# EAGLE design untitled 5 (EAGLE 7.5.0)
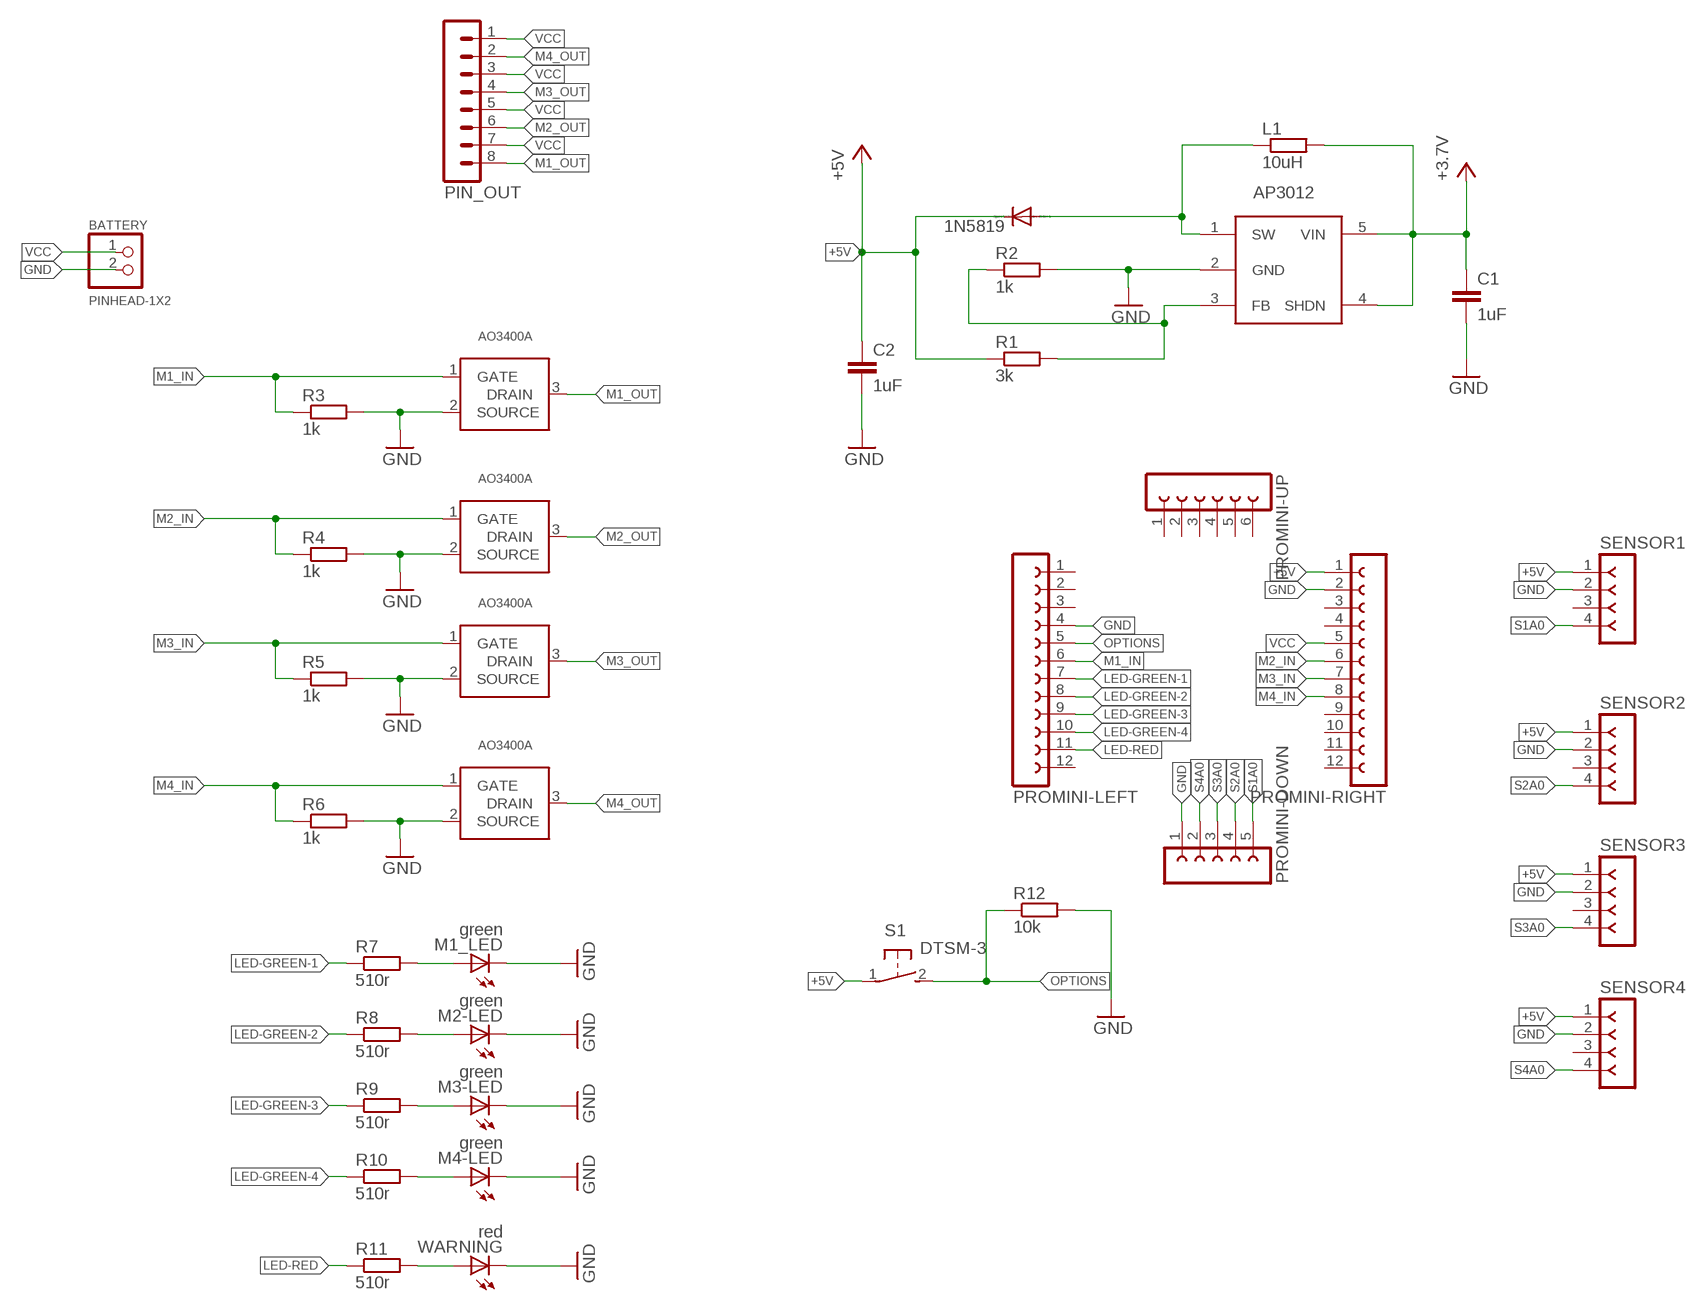
[diagram p0: schematic, sheet 1]

## Parts
1N5819  DIODE-DO214AC  [DO214AC]
BATTERY  PINHEAD-1X2  [PIHEAD-1X2]
C1  1uF  C-EUC1206  [C1206]
C2  1uF  C-EUC1206  [C1206]
L1  10uH  R-EU_R0805  [R0805]
M1_LED  green  LEDCHIP-LED0805  [CHIP-LED0805]
M2-LED  green  LEDCHIP-LED0805  [CHIP-LED0805]
M3-LED  green  LEDCHIP-LED0805  [CHIP-LED0805]
M4-LED  green  LEDCHIP-LED0805  [CHIP-LED0805]
MOSFET1  AO3400A  [SOT-23]
MOSFET2  AO3400A  [SOT-23]
MOSFET3  AO3400A  [SOT-23]
MOSFET4  AO3400A  [SOT-23]
PIN_OUT  MA08-1  [MA08-1]
PROMINI-DOWN  FE05-1  [FE05-1]
PROMINI-LEFT  FE12-1  [FE12]
PROMINI-RIGHT  FE12-1  [FE12]
PROMINI-UP  FE06-1  [FE06]
R1  3k  R-EU_R1206  [R1206]
R2  1k  R-EU_R1206  [R1206]
R3  1k  R-EU_R1206  [R1206]
R4  1k  R-EU_R1206  [R1206]
R5  1k  R-EU_R1206  [R1206]
R6  1k  R-EU_R1206  [R1206]
R7  510r  R-EU_M0805  [M0805]
R8  510r  R-EU_M0805  [M0805]
R9  510r  R-EU_M0805  [M0805]
R10  510r  R-EU_M0805  [M0805]
R11  510r  R-EU_M0805  [M0805]
R12  10k  R-EU_R1206  [R1206]
S1  DTSM-3  [DTSM-3]
SENSOR1  F-1X04-SIP-100-32Y  [SIP-100-04-32Y]
SENSOR2  F-1X04-SIP-100-32Y  [SIP-100-04-32Y]
SENSOR3  F-1X04-SIP-100-32Y  [SIP-100-04-32Y]
SENSOR4  F-1X04-SIP-100-32Y  [SIP-100-04-32Y]
U$1  AP3012  [SOT-23-5]
WARNING  red  LEDCHIP-LED0805  [CHIP-LED0805]

## Nets
+5V: 1N5819.C C2.1 PROMINI-RIGHT.1 R1.1 S1.1 SENSOR1.1 SENSOR2.1 SENSOR3.1 SENSOR4.1
GND: BATTERY.2 C1.2 C2.2 M1_LED.C M2-LED.C M3-LED.C M4-LED.C MOSFET1.2(SOURCE) MOSFET2.2(SOURCE) MOSFET3.2(SOURCE) MOSFET4.2(SOURCE) PROMINI-DOWN.1 PROMINI-LEFT.4 PROMINI-RIGHT.2 R2.2 R3.2 R4.2 R5.2 R6.2 R12.2 SENSOR1.2 SENSOR2.2 SENSOR3.2 SENSOR4.2 U$1.2(GND) WARNING.C
LED-GREEN-1: PROMINI-LEFT.7 R7.1
LED-GREEN-2: PROMINI-LEFT.8 R8.1
LED-GREEN-3: PROMINI-LEFT.9 R9.1
LED-GREEN-4: PROMINI-LEFT.10 R10.1
LED-RED: PROMINI-LEFT.11 R11.1
M1_IN: MOSFET1.1(GATE) PROMINI-LEFT.6 R3.1
M1_OUT: MOSFET1.3(DRAIN) PIN_OUT.8
M2_IN: MOSFET2.1(GATE) PROMINI-RIGHT.6 R4.1
M2_OUT: MOSFET2.3(DRAIN) PIN_OUT.6
M3_IN: MOSFET3.1(GATE) PROMINI-RIGHT.7 R5.1
M3_OUT: MOSFET3.3(DRAIN) PIN_OUT.4
M4_IN: MOSFET4.1(GATE) PROMINI-RIGHT.8 R6.1
M4_OUT: MOSFET4.3(DRAIN) PIN_OUT.2
N$1: 1N5819.A L1.1 U$1.1(SW)
N$3: R1.2 R2.1 U$1.3(FB)
N$4: R11.2 WARNING.A
N$5: M4-LED.A R10.2
N$6: M3-LED.A R9.2
N$7: M2-LED.A R8.2
N$8: M1_LED.A R7.2
OPTIONS: PROMINI-LEFT.5 R12.1 S1.2
S1A0: PROMINI-DOWN.5 SENSOR1.4
S2A0: PROMINI-DOWN.4 SENSOR2.4
S3A0: PROMINI-DOWN.3 SENSOR3.4
S4A0: PROMINI-DOWN.2 SENSOR4.4
VCC: BATTERY.1 C1.1 L1.2 PIN_OUT.1 PIN_OUT.3 PIN_OUT.5 PIN_OUT.7 PROMINI-RIGHT.5 U$1.4(SHDN) U$1.5(VIN) ; supply symbol labelled +3.7V
Unconnected: PROMINI-LEFT.1 PROMINI-LEFT.2 PROMINI-LEFT.3 PROMINI-LEFT.12 PROMINI-RIGHT.3 PROMINI-RIGHT.4 PROMINI-RIGHT.9 PROMINI-RIGHT.10 PROMINI-RIGHT.11 PROMINI-RIGHT.12 PROMINI-UP.1 PROMINI-UP.2 PROMINI-UP.3 PROMINI-UP.4 PROMINI-UP.5 PROMINI-UP.6 SENSOR1.3 SENSOR2.3 SENSOR3.3 SENSOR4.3

## Library data of the parts
1N5819 = diode:DIODE-: DIODE
BATTERY = mcp73831:PINHEAD-1X2
C1 C2 = resistor:C-EU: CAPACITOR, European symbol
L1 R1-R12 = resistor:R-EU_: RESISTOR, European symbol
M1_LED M2-LED M3-LED M4-LED WARNING = led:LED: LED OSRAM: - CHIPLED LG R971, LG N971, LY N971, LG Q971, LY Q971, LO R971, LY R971 LH N974, LH R974 LS Q976, LO Q976, LY Q976 LO Q996 - Hyper CHIPLED LW Q18S LB Q993, LB Q99A, LB R99A - SideLED LS A670, LO A670, LY A670, LG A670, LP A670 LB A673, LV A673, LT A673, LW A673 LH A674 LY A675 LS A676, LA A676, LO A676, LY A676, LW A676 LS A679, LY A679, LG A679 - Hyper Micro SIDELED® LS Y876, LA Y876, LO Y876, LY Y876 LT Y87S - SmartLED LW L88C, LW L88S LB L89C, LB L89S, LG L890 LS L89K, LO L89K, LY L89K LS L896, LA L896, LO L896, LY L896 - TOPLED LS T670, LO T670, LY T670, LG T670, LP T670 LSG T670, LSP T670, LSY T670, LOP T670, LYG T670 LG T671, LOG T671, LSG T671 LB T673, LV T673, LT T673, LW T673 LH T674 LS T676, LA T676, LO T676, LY T676, LB T676, LH T676, LSB T676, LW T676 LB T67C, LV T67C, LT T67C, LS T67K, LO T67K, LY T67K, LW E67C LS E67B, LA E67B, LO E67B, LY E67B, LB E67C, LV E67C, LT E67C LW T67C LS T679, LY T679, LG T679 LS T770, LO T770, LY T770, LG T770, LP T770 LB T773, LV T773, LT T773, LW T773 LH T774 LS E675, LA E675, LY E675, LS T675 LS T776, LA T776, LO T776, LY T776, LB T776 LHGB T686 LT T68C, LB T68C - Hyper Mini TOPLED® LB M676 - Mini TOPLED Santana® LG M470 LS M47K, LO M47K, LY M47K Source: http://www.osram.convergy.de LUXEON: - LUMILED® LXK2-PW12-R00, LXK2-PW12-S00, LXK2-PW14-U00, LXK2-PW14-V00 LXK2-PM12-R00, LXK2-PM12-S00, LXK2-PM14-U00 LXK2-PE12-Q00, LXK2-PE12-R00, LXK2-PE12-S00, LXK2-PE14-T00, LXK2-PE14-U00 LXK2-PB12-K00, LXK2-PB12-L00, LXK2-PB12-M00, LXK2-PB14-N00, LXK2-PB14-P00, LXK2-PB14-Q00 LXK2-PR12-L00, LXK2-PR12-M00, LXK2-PR14-Q00, LXK2-PR14-R00 LXK2-PD12-Q00, LXK2-PD12-R00, LXK2-PD12-S00 LXK2-PH12-R00, LXK2-PH12-S00 LXK2-PL12-P00, LXK2-PL12-Q00, LXK2-PL12-R00 Source: www.luxeon.com KINGBRIGHT: KA-3528ASYC Source: www.kingbright.com
MOSFET1-MOSFET4 = smd-footprints:AO3400A
PIN_OUT = con-lstb:MA08-1: PIN HEADER; OC_FARNELL: unknown; OC_NEWARK: unknown
PROMINI-DOWN = con-lsta:FE05-1: FEMALE HEADER; OC_FARNELL: unknown; OC_NEWARK: unknown
PROMINI-LEFT PROMINI-RIGHT = con-lsta:FE12-1: FEMALE HEADER; OC_FARNELL: unknown; OC_NEWARK: unknown
PROMINI-UP = con-lsta:FE06-1: FEMALE HEADER; OC_FARNELL: unknown; OC_NEWARK: unknown
S1 = switch-tact:DTSM-3
SENSOR1-SENSOR4 = con-headers-jp:F-1X04-: FEMALE HEADER
U$1 = smd-footprints:AP3012

## Board
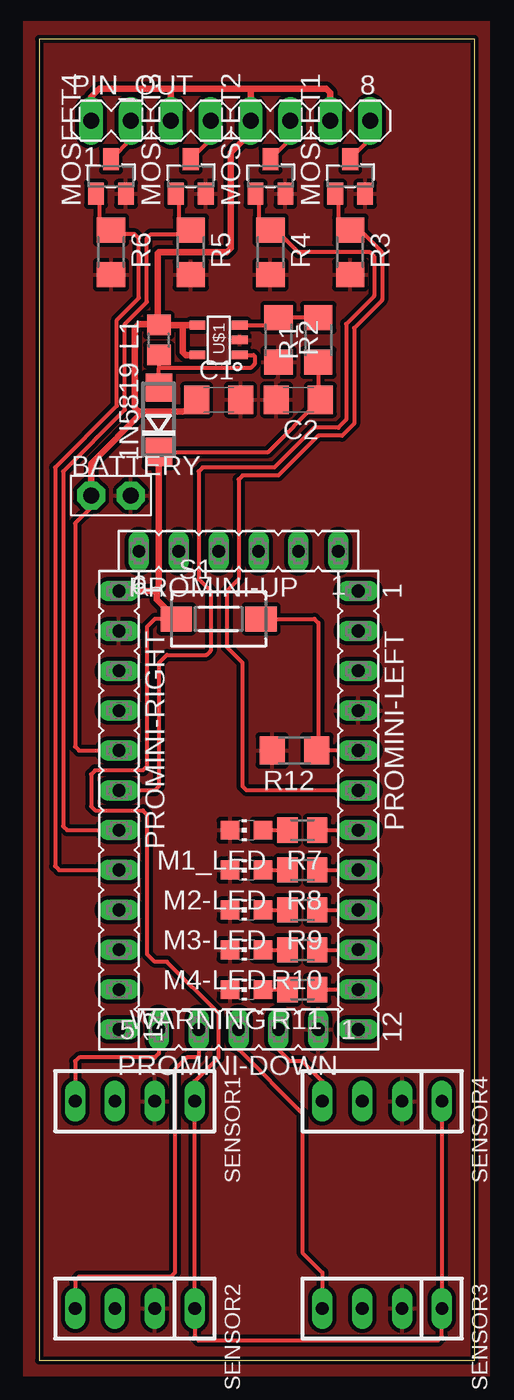
[diagram p1: board, top side]

Size 27.74 x 84.19 mm. Coordinates in mm from the lower left corner, seen from the top.
Outline: 0,0 27.74,0 27.74,84.19 0,84.19 0,0
Copper layers (1*16): Top 0.035mm / dielectric 1.5mm / Bottom 0.035mm
Design rules "default 10mils": minimum track width 10mil, minimum drill 24mil, track to track 10mil, track to pad 10mil, pad to pad 10mil, via to via 10mil, smd to smd 10mil, copper to edge 10mil, drill to drill 10mil, minimum pad ring 10mil, minimum via ring 8mil, stop-mask expansion 4mil, vias tented up to drill 0mil, thermal gap 12mil

### Footprints (pad centres in the part's own frame; a part is rotated, then mirrored left to right if it is on the bottom)
DO214AC = smd 1.8 x 1.7: A 2.05,0; C -2.05,0
PIHEAD-1X2 = drill 1.016 pad 1.778 octagon: 1 -1.27,0; 2 1.27,0
C1206 = smd 1.6 x 1.8: 1 -1.4,0; 2 1.4,0
R0805 = smd 1.3 x 1.5: 1 -0.95,0; 2 0.95,0
CHIP-LED0805 = smd 1.2 x 1.2: A 0,-1.05; C 0,1.05
SOT-23 = smd 1 x 1.4: 1 -0.95,-1.1; 2 0.95,-1.1; 3 0,1.1
MA08-1 = drill 1.016 long: 1 -8.89,0; 2 -6.35,0; 3 -3.81,0; 4 -1.27,0; 5 1.27,0; 6 3.81,0; 7 6.35,0; 8 8.89,0
FE05-1 = drill 0.813 long: 1 -5.08,0; 2 -2.54,0; 3 0,0; 4 2.54,0; 5 5.08,0
FE12 = drill 0.813 long: 1 -13.97,0; 2 -11.43,0; 3 -8.89,0; 4 -6.35,0; 5 -3.81,0; 6 -1.27,0; 7 1.27,0; 8 3.81,0; 9 6.35,0; 10 8.89,0; 11 11.43,0; 12 13.97,0
FE06 = drill 0.813 long: 1 -6.35,0; 2 -3.81,0; 3 -1.27,0; 4 1.27,0; 5 3.81,0; 6 6.35,0
R1206 = smd 1.6 x 1.803: 1 -1.422,0; 2 1.422,0
M0805 = smd 1.3 x 1.6: 1 -0.95,0; 2 0.95,0
DTSM-3 = smd 2 x 1.6: 1 -2.7,0; 2 2.7,0
SIP-100-04-32Y = drill 0.813 long: 1 -3.81,0; 2 -1.27,0; 3 1.27,0; 4 3.81,0
SOT-23-5 = smd 1 x 0.55: 1 -1.35,0.95; 2 -1.35,0; 3 -1.35,-0.95; 4 1.35,-0.95; 5 1.35,0.95

### Placement (x,y rotation side)
1N5819  7.62,59.94 90 top
BATTERY  4.57,55.12 0 top
C1  11.43,61.21 0 top
C2  16.51,61.21 180 top
L1  7.62,65.02 90 top
M1_LED  13.21,33.78 90 top
M2-LED  13.21,31.24 90 top
M3-LED  13.21,28.7 90 top
M4-LED  13.21,26.16 90 top
MOSFET1  19.81,75.44 0 top
MOSFET2  14.73,75.44 0 top
MOSFET3  9.65,75.44 0 top
MOSFET4  4.57,75.44 0 top
PIN_OUT  12.19,78.99 0 top
PROMINI-DOWN  12.7,21.08 180 top
PROMINI-LEFT  20.32,35.05 270 top
PROMINI-RIGHT  5.08,35.05 270 top
PROMINI-UP  12.7,51.56 180 top
R1  17.78,65.02 90 top
R2  15.24,65.02 270 top
R3  19.81,70.61 270 top
R4  14.73,70.61 270 top
R5  9.65,70.61 270 top
R6  4.57,70.61 270 top
R7  16.76,33.78 180 top
R8  16.76,31.24 180 top
R9  16.76,28.7 180 top
R10  16.76,26.16 180 top
R11  16.76,23.62 180 top
R12  16.26,38.86 180 top
S1  11.43,47.24 0 top
SENSOR1  6.1,16.51 180 top
SENSOR2  6.1,3.3 180 top
SENSOR3  21.84,3.3 180 top
SENSOR4  21.84,16.51 180 top
U$1  11.43,65.02 180 top
WARNING  13.21,23.62 90 top

### Tracks (layer width: path | path; a pad name or v marks a point on that pad's centre or on a via)
+5V
  Top 0.254: R1.1 17.78,61.34 C2.1 14.59,57.89 1N5819.C | 9.4,47.24 7.37,47.24 6.86,46.74 6.86,37.85 6.6,37.59 3.56,37.59 3.3,37.34 3.3,35.31 3.56,35.05 6.6,35.05 6.86,34.8 6.86,25.91 7.37,25.4 8.13,25.4 11.43,22.1 11.43,19.3 9.91,17.78 SENSOR1.1 SENSOR2.1 9.91,1.52 10.16,1.27 25.4,1.27 25.65,1.52 SENSOR3.1 SENSOR4.1
  Top 0.406: 7.49,49.15 7.62,49.28 1N5819.C | 7.49,49.15 7.37,49.02 PROMINI-RIGHT.1 | 9.4,47.24 S1.1 7.49,48.48 7.49,49.15
GND
  Top 0.254: MOSFET3.2 10.75,74.34 | MOSFET2.2 15.83,74.34 | MOSFET1.2 20.91,74.34 | 14.73,64.01 14.83,64.01 R2.2 | R5.2 9.88,69.19 | R4.2 15.09,69.19
  pour Top: 0,84.33 27.94,84.33 27.94,0 0,0
LED-GREEN-1
  Top 0.254: R7.1 PROMINI-LEFT.7
LED-GREEN-2
  Top 0.254: R8.1 PROMINI-LEFT.8
LED-GREEN-3
  Top 0.254: R9.1 PROMINI-LEFT.9
LED-GREEN-4
  Top 0.254: R10.1 PROMINI-LEFT.10
LED-RED
  Top 0.254: R11.1 PROMINI-LEFT.11
M1_IN
  Top 0.254: MOSFET1.1 19.05,74.34 19.05,72.01 19.81,72.01 R3.1 19.96,71.88 20.57,71.88 21.84,70.61 21.84,67.56 20.07,65.79 20.07,59.69 19.3,58.93 17.78,58.93 15.24,56.39 12.95,56.39 12.7,56.13 12.7,49.78 11.94,49.02 11.94,45.47 12.95,44.45 12.95,36.58 13.21,36.32 PROMINI-LEFT.6
M1_OUT
  Top 0.254: MOSFET1.3 19.81,76.58 21.08,77.85 PIN_OUT.8
M2_IN
  Top 0.254: MOSFET2.1 13.97,74.34 13.97,72.01 14.73,72.01 R4.1 14.88,71.88 15.24,71.88 16.51,70.61 21.08,70.61 21.34,70.36 21.34,67.82 19.56,66.04 19.56,59.94 19.05,59.44 17.53,59.44 14.99,56.9 10.41,56.9 10.16,56.64 10.16,49.78 10.92,49.02 10.92,45.21 10.67,44.96 8.13,44.96 7.62,44.45 7.62,36.58 7.37,36.32 PROMINI-RIGHT.6
M2_OUT
  Top 0.254: MOSFET2.3 16,77.81 PIN_OUT.6
M3_IN
  Top 0.254: R5.1 9.63,72.01 8.89,72.01 8.89,74.34 MOSFET3.1 | 9.5,71.88 R5.1 | R5.1 9.37,71.75 7.11,71.75 6.86,71.5 6.86,67.44 5.46,66.04 5.46,60.58 1.52,56.64 1.52,34.04 1.78,33.78 PROMINI-RIGHT.7
M3_OUT
  Top 0.254: MOSFET3.3 10.92,77.81 PIN_OUT.4
M4_IN
  Top 0.254: MOSFET4.1 3.81,74.34 3.81,72.01 4.55,72.01 R6.1 4.85,71.75 6.1,71.75 6.35,71.5 6.35,67.69 4.95,66.29 4.95,60.83 1.02,56.9 1.02,31.5 1.27,31.24 PROMINI-RIGHT.8
M4_OUT
  Top 0.254: MOSFET4.3 5.84,77.81 PIN_OUT.2
N$1
  Top 0.254: U$1.1 13.65,64.07 13.72,64.01 13.72,63.5 13.46,63.25 7.62,63.25 | L1.1 7.62,63.25 | 1N5819.A 7.62,63.25
N$2
  pour Top: -1.02,85.34 28.7,85.34 28.7,-1.02 -1.02,-1.02
N$3
  Top 0.254: R1.2 R2.1 14.77,65.97 U$1.3
N$4
  Top 0.254: WARNING.A R11.2
N$5
  Top 0.254: M4-LED.A R10.2
N$6
  Top 0.254: M3-LED.A R9.2
N$7
  Top 0.254: M2-LED.A R8.2
N$8
  Top 0.254: M1_LED.A R7.2
OPTIONS
  Top 0.254: S1.2 17.53,47.24 17.78,46.99 17.78,38.96 R12.1 PROMINI-LEFT.5
S1A0
  Top 0.254: PROMINI-DOWN.5 7.62,19.56 7.37,19.3 2.54,19.3 2.29,19.05 SENSOR1.4
S2A0
  Top 0.254: PROMINI-DOWN.4 10.16,19.3 9.4,19.3 8.64,18.54 8.64,5.59 8.38,5.33 2.54,5.33 2.29,5.08 SENSOR2.4
S3A0
  Top 0.254: PROMINI-DOWN.3 12.7,19.81 16.76,15.75 16.76,6.86 18.03,5.59 SENSOR3.4
S4A0
  Top 0.254: SENSOR4.4 18.03,17.78 16.76,19.05 16,19.05 15.24,19.81 PROMINI-DOWN.2
VCC
  Top 0.254: C1.1 9.91,61.21 9.14,60.45 | 7.55,66.04 L1.2 | 7.55,70.55 7.62,70.61 | PROMINI-RIGHT.5 2.54,38.86 2.29,39.12 2.29,53.34 3.3,54.36 BATTERY.1
  Top 0.406: PIN_OUT.1 3.3,80.52 3.81,81.03 8.38,81.03 | PIN_OUT.7 18.54,80.77 18.29,81.03 13.46,81.03 | PIN_OUT.3 8.38,81.03 | U$1.4 9.14,65.97 | 9.14,65.97 L1.2 | U$1.5 9.33,64.07 9.14,64.26 9.14,65.97 | 9.14,60.45 6.6,60.45 | 6.6,60.45 6.35,60.45 6.1,60.71 6.1,65.79 6.35,66.04 7.55,66.04 7.55,70.55 | 7.62,70.61 11.94,70.61 12.19,70.87 12.19,76.96 13.21,77.98 13.21,78.74 PIN_OUT.5 13.46,81.03 | 13.46,81.03 8.38,81.03 | BATTERY.1 3.3,57.15 6.6,60.45

### Text on the board
Description: VCC | M4 / OUT | VCC | M3 / OUT | VCC | M2 / OUT | VCC | M1 / OUT | +- | 3.7V | PODLEWACZ v0.5 by Sh4DoV | promini | 1 | 2 | 3 | 12 | 4 | 11 | A0 | A0 | Sensor1 | Sensor4 | Sensor2 | Sensor3 | A0 | A0